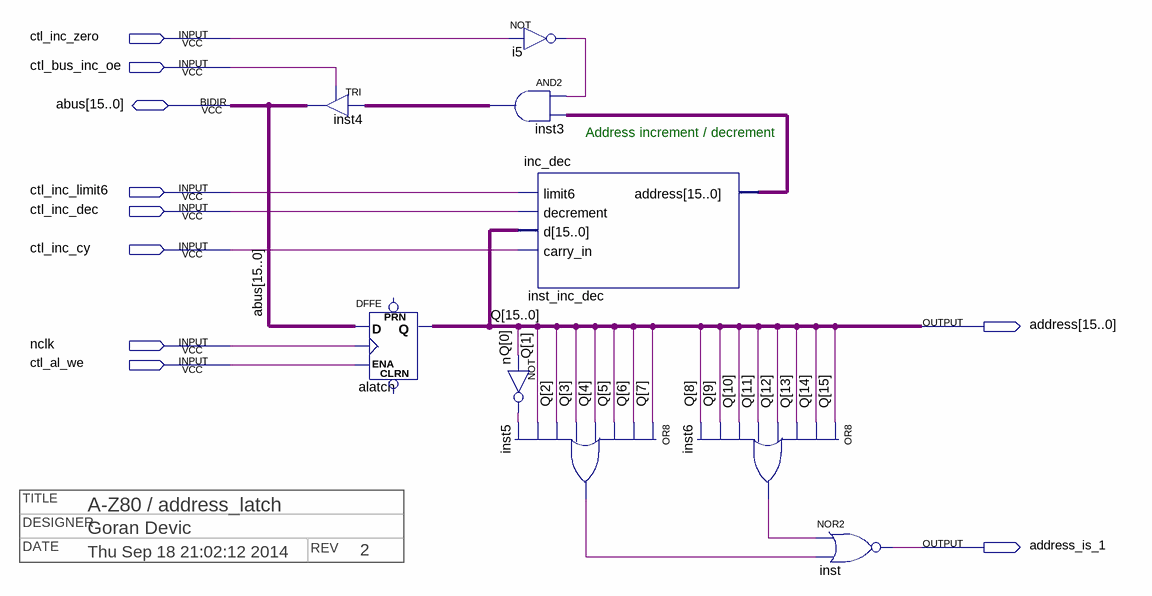
[diagram p0: schematic sheet]
// Quartus schematic address_latch.bdf as structural Verilog: 9 symbols, 10 pins
// Title block: TITLE: A-Z80 / address_latch; DESIGNER: Goran Devic; DATE: Thu Sep 18 21:02:12 2014; REV: 2
module address_latch (
  input  ctl_inc_zero,
  input  ctl_bus_inc_oe,
  input  ctl_inc_limit6,
  input  ctl_inc_dec,
  input  ctl_inc_cy,
  input  nclk,
  input  ctl_al_we,
  inout  [15:0] abus,
  output [15:0] address,
  output address_is_1
);

  wire i5_out, inst5_out, inst6_out, n_out;
  wire [15:0] inst3_out, inst_inc_dec_address;

  TRI inst4[15:0] (.IN(inst3_out), .OE(ctl_bus_inc_oe), .OUT(abus));
  DFFE alatch[15:0] (.D(abus), .CLK(nclk), .ENA(ctl_al_we), .Q(address));  // open: PRN, CLRN
  not i5 (i5_out, ctl_inc_zero);
  assign inst3_out = {16{i5_out}} & inst_inc_dec_address;  // AND2 inst3, 16 bits wide
  inc_dec inst_inc_dec (
    .limit6(ctl_inc_limit6), .decrement(ctl_inc_dec), .d(address), .carry_in(ctl_inc_cy),
    .address(inst_inc_dec_address));
  not n (n_out, address[0]);
  or inst5 (inst5_out, address[7], address[6], address[5], address[4], address[3], address[2], address[1], n_out);
  or inst6 (inst6_out, address[15], address[14], address[13], address[12], address[11], address[10], address[9], address[8]);
  nor inst (address_is_1, inst6_out, inst5_out);

  // Other names for the same wires on the sheet: Q[15:0] = address

  // Notes on the sheet:
  //   Address increment / decrement
endmodule
